# EAGLE schematic 74hct245 (EAGLE 9.3.0)
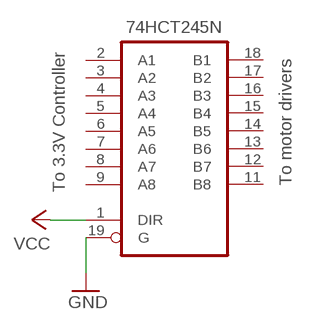
[diagram p0: schematic, sheet 1]

## Parts
IC1  74HCT245N  [DIL20]

## Nets
GND: IC1.19(G)
VCC: IC1.1(DIR)
Unconnected: IC1.2(A1) IC1.3(A2) IC1.4(A3) IC1.5(A4) IC1.6(A5) IC1.7(A6) IC1.8(A7) IC1.9(A8) IC1.11(B8) IC1.12(B7) IC1.13(B6) IC1.14(B5) IC1.15(B4) IC1.16(B3) IC1.17(B2) IC1.18(B1)

## Notes on the sheet
- To 3.3V Controller | To motor drivers

## Power pins joined to a net without a drawn wire
GND: IC1.10(GND)
VCC: IC1.20(VCC)

## Library data of the parts
IC1 = 74xx-eu:74*245: Octal BUS TRANSCEIVER, 3-state